# EAGLE design sonar_ampandadc (EAGLE 7.6.0)

## Sheet 1 of 2: Differential VGA Breakout Board Purpose: ARVP SONAR system for 2017 RoboSub competition lmh6514 <http://www.ti.com/lit/ds/symlink/lmh6514.pdf> to be used for prototype v1. Created by Mike Bardwell (10/2016) Parts List 43nH Inductor <http://www.digikey.ca/product-detail/en/murata-electronics-north-america/LQW15AN43NJ00D/490-6818-1-ND/3846015> 10 pF Capacitor <http://www.digikey.ca/product-detail/en/kemet/C0603C100J5GACTU/399-1049-1-ND/411324>
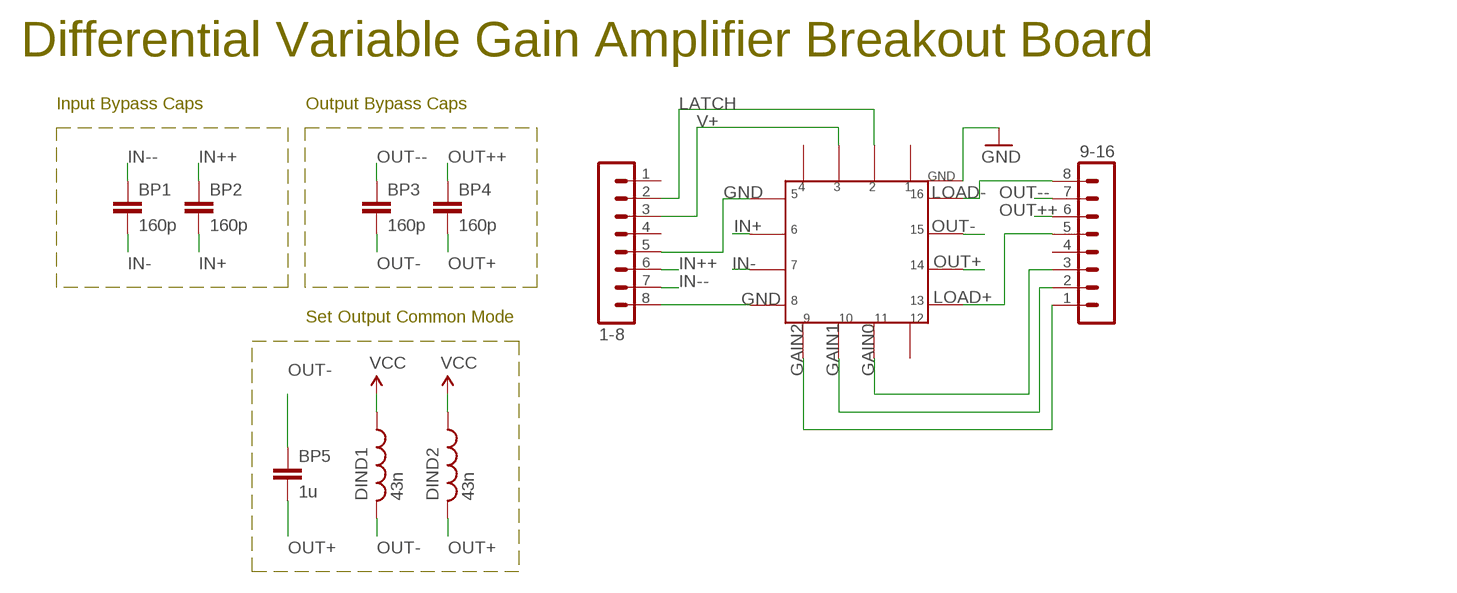
[diagram p0: schematic, sheet 1]

### Parts
1-8  MA08-1  [MA08-1]
9-16  MA08-1  [MA08-1]
BP1  160p  CAP0603-CAP  [0603-CAP]
BP2  160p  CAP0603-CAP  [0603-CAP]
BP3  160p  CAP0603-CAP  [0603-CAP]
BP4  160p  CAP0603-CAP  [0603-CAP]
BP5  1u  CAP0603-CAP  [0603-CAP]
DIND1  43n  L-0402  [0402-RES]
DIND2  43n  L-0402  [0402-RES]
U$1  LMH6514  [WQFN4X4]

### Nets
GAIN0: 9-16.3 U$1.P$11
GAIN1: 9-16.2 U$1.P$10
GAIN2: 9-16.1 U$1.P$9
GND: 1-8.5 1-8.8 U$1.GND U$1.P$5 U$1.P$8 ; also sheet 2
IN+: BP2.2 U$1.P$6
IN++: 1-8.6 BP2.1
IN-: BP1.2 U$1.P$7
IN--: 1-8.7 BP1.1
LATCH: 1-8.2 U$1.P$2
LOAD+: 9-16.5 U$1.P$13 ; also sheet 2
LOAD-: 9-16.8 U$1.P$16 ; also sheet 2
OUT+: BP4.2 BP5.2 DIND2.2 U$1.P$14
OUT++: 9-16.6 BP4.1 ; also sheet 2
OUT-: BP3.2 BP5.1 DIND1.2 U$1.P$15
OUT--: 9-16.7 BP3.1 ; also sheet 2
V+: 1-8.3 DIND1.1 DIND2.1 U$1.P$3 ; supply symbol labelled VCC ; also sheet 2
Unconnected: 1-8.1 1-8.4 9-16.4 U$1.P$1 U$1.P$4 U$1.P$12

### Notes on the sheet
- Differential Variable Gain Amplifier Breakout Board
- Input Bypass Caps | Output Bypass Caps
- Set Output Common Mode

## Sheet 2 of 2: ADS8318 ADC Datasheet <http://www.ti.com/lit/ds/symlink/ads8318.pdf> Created by Mike Bardwell (12/2016)
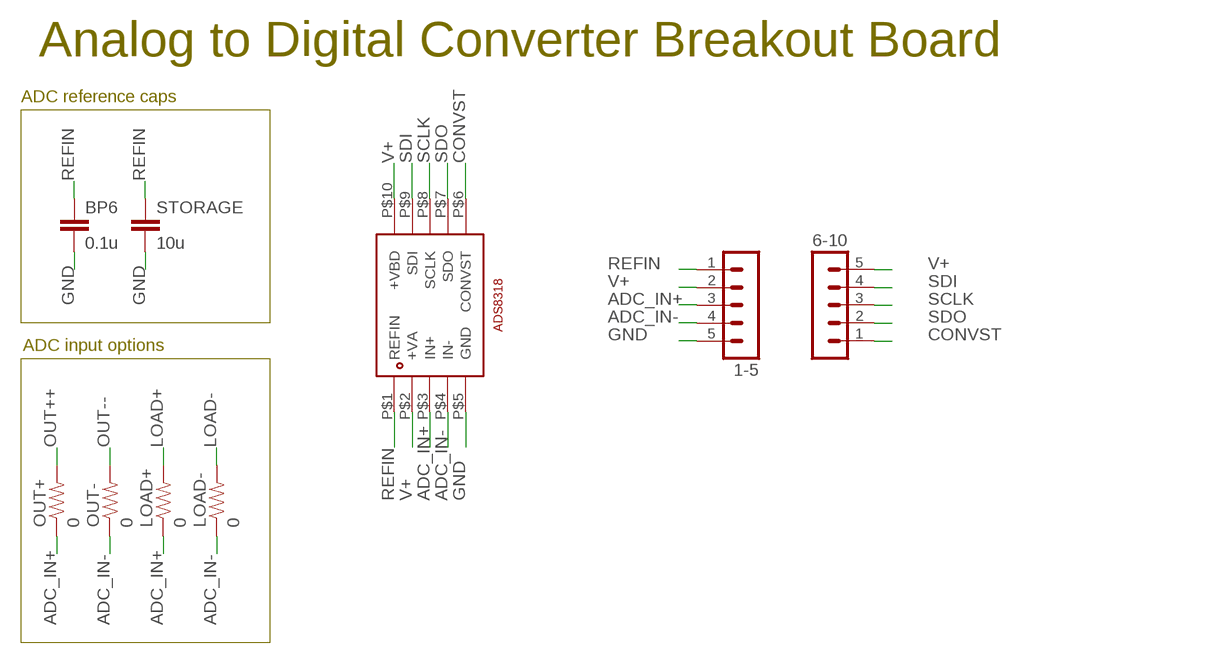
[diagram p1: schematic, sheet 2]

### Parts
1-5  MA05-1  [MA05-1]
6-10  MA05-1  [MA05-1]
BP6  0.1u  CAP0603-CAP  [0603-CAP]
LOAD+  0  RESISTOR0603  [0603-RES]
LOAD-  0  RESISTOR0603  [0603-RES]
OUT+  0  RESISTOR0603  [0603-RES]
OUT-  0  RESISTOR0603  [0603-RES]
STORAGE  10u  CAP0603-CAP  [0603-CAP]
U$2  ADS8318  [10-VSSOP]

### Nets
ADC_IN+: 1-5.3 LOAD+.1 OUT+.1 U$2.P$3(IN+)
ADC_IN-: 1-5.4 LOAD-.1 OUT-.1 U$2.P$4(IN-)
CONVST: 6-10.1 U$2.P$6(CONVST)
GND: 1-5.5 BP6.2 STORAGE.2 U$2.P$5(GND) ; also sheet 1
LOAD+: LOAD+.2 ; also sheet 1
LOAD-: LOAD-.2 ; also sheet 1
OUT++: OUT+.2 ; also sheet 1
OUT--: OUT-.2 ; also sheet 1
REFIN: 1-5.1 BP6.1 STORAGE.1 U$2.P$1(REFIN)
SCLK: 6-10.3 U$2.P$8(SCLK)
SDI: 6-10.4 U$2.P$9(SDI)
SDO: 6-10.2 U$2.P$7(SDO)
V+: 1-5.2 6-10.5 U$2.P$2(+VA) U$2.P$10(+VBD) ; also sheet 1

### Notes on the sheet
- Analog to Digital Converter Breakout Board
- ADC reference caps
- ADC input options

## Library data of the parts
1-5 6-10 = con-lstb:MA05-1: PIN HEADER; OC_FARNELL: unknown; OC_NEWARK: unknown
1-8 9-16 = con-lstb:MA08-1: PIN HEADER; OC_FARNELL: unknown; OC_NEWARK: unknown
BP1-BP6 STORAGE = SparkFun-Capacitors:CAP: Capacitor Standard 0603 ceramic capacitor, and 0.1" leaded capacitor.
DIND1 DIND2 = SONAR:L-0402
LOAD+ LOAD- OUT+ OUT- = SparkFun-Resistors:RESISTOR: Resistor Basic schematic elements and footprints for 0603, 1206, and PTH resistors.
U$1 = SONAR:LMH6514: Differential VGA Purpose: ARVP SONAR system for 2017 RoboSub competition lmh6514 <http://www.ti.com/lit/ds/symlink/lmh6514.pdf> to be used for prototype v1. Created by Mike Bardwell (10/2016) Adjustable Gain with a 42 dB Range Precise 6.02 dB Gain Steps Parallel 3 Bit Gain Control On Chip Register Gain Setting Fully Differential Signal Path Single Ended to Differential Capable 200Ω Input Impedance Small Footprint (4 mm x 4 mm) WQFN Package
U$2 = SONAR:ADS8318

## Board
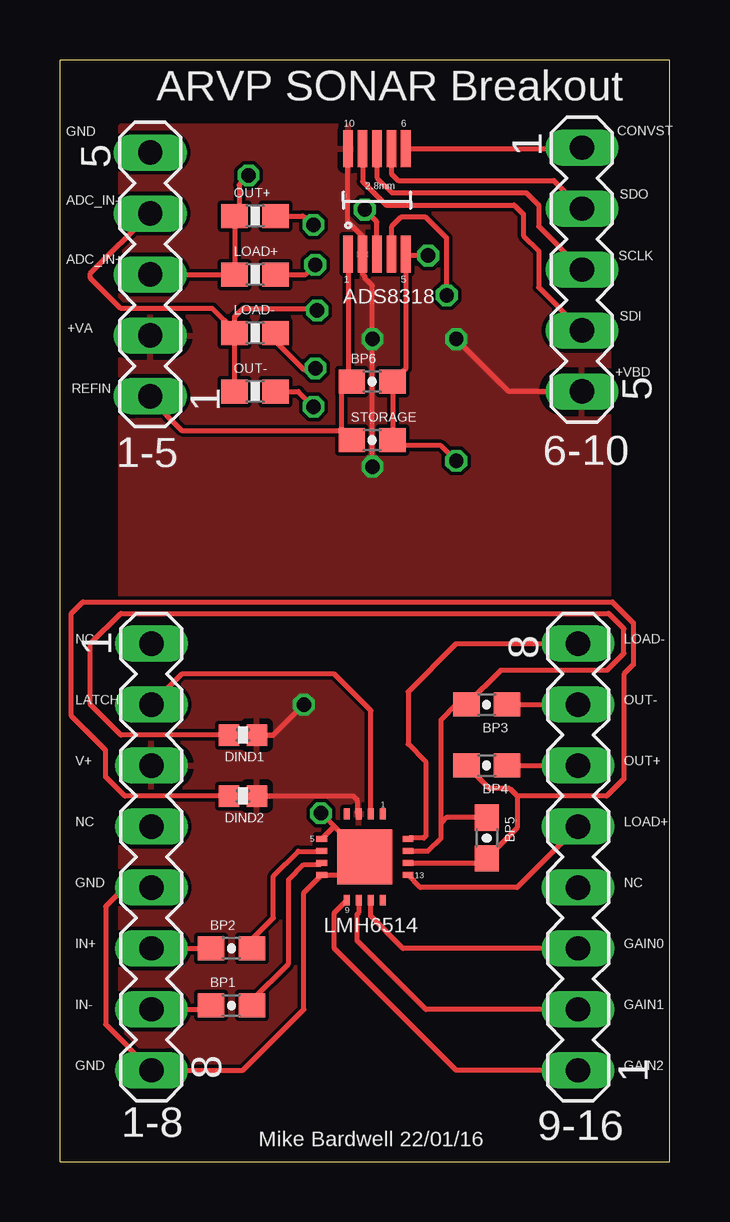
[diagram p2: board, top side]
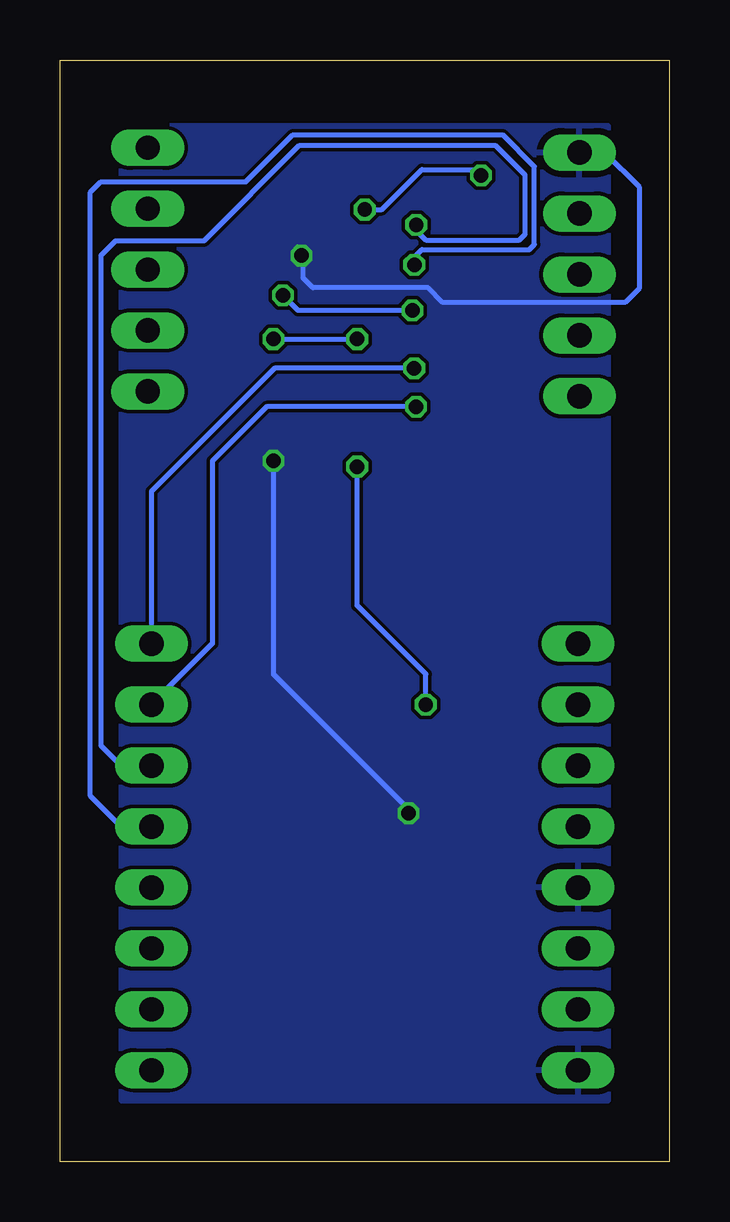
[diagram p3: board, bottom side, seen from below]

Size 25.4 x 45.92 mm. Coordinates in mm from the lower left corner, seen from the top.
Outline: 0,0 25.4,0 25.4,45.92 0,45.92 0,0
Copper layers (1*16): Top 0.035mm / dielectric 1.5mm / Bottom 0.035mm
Design rules "ITEADstudioDRC_fromARVPgit": minimum track width 6mil, minimum drill 12mil, track to track 6mil, track to pad 6mil, pad to pad 6mil, via to via 6mil, smd to smd 0mil, copper to edge 10mil, drill to drill 10mil, minimum pad ring 10mil, minimum via ring 6mil, stop-mask expansion 2mil, vias tented up to drill 100mil, thermal gap 10mil

### Footprints (pad centres in the part's own frame; a part is rotated, then mirrored left to right if it is on the bottom)
MA05-1 = drill 1.016 long: 1 -5.08,0; 2 -2.54,0; 3 0,0; 4 2.54,0; 5 5.08,0
MA08-1 = drill 1.016 long: 1 -8.89,0; 2 -6.35,0; 3 -3.81,0; 4 -1.27,0; 5 1.27,0; 6 3.81,0; 7 6.35,0; 8 8.89,0
0603-CAP = smd 1.1 x 1: 1 -0.85,0; 2 0.85,0
0402-RES = smd 0.85 x 0.9: 1 -0.58,0; 2 0.58,0
0603-RES = smd 1.1 x 1: 1 -0.85,0; 2 0.85,0
WQFN4X4 = smd 2.3 x 2.3: GND 0,0 | smd 0.25 x 0.45: P$1 0.75,1.8; P$2 0.25,1.8; P$3 -0.25,1.8; P$4 -0.75,1.8; P$9 -0.75,-1.8; P$10 -0.25,-1.8; P$11 0.25,-1.8; P$12 0.75,-1.8 | smd 0.45 x 0.25: P$5 -1.8,0.75; P$6 -1.8,0.25; P$7 -1.8,-0.25; P$8 -1.8,-0.75; P$13 1.8,-0.75; P$14 1.8,-0.25; P$15 1.8,0.25; P$16 1.8,0.75
10-VSSOP = smd 0.4 x 1.55: P$1 -1.2,-2.2; P$2 -0.6,-2.2; P$3 0,-2.2; P$4 0.6,-2.2; P$5 1.2,-2.2; P$6 1.2,2.2; P$7 0.6,2.2; P$8 0,2.2; P$9 -0.6,2.2; P$10 -1.2,2.2

### Placement (x,y rotation side)
1-5  3.76,36.98 90 top
1-8  3.81,12.7 270 top
6-10  21.74,37.19 270 top
9-16  21.59,12.7 90 top
BP1  7.14,6.51 0 top
BP2  7.14,8.89 0 top
BP3  17.78,19.05 180 top
BP4  17.78,16.51 180 top
BP5  17.78,13.49 270 top
BP6  13,32.51 0 top
DIND1  7.62,17.78 180 top
DIND2  7.62,15.24 180 top
LOAD+  8.13,36.98 0 top
LOAD-  8.13,34.54 0 top
OUT+  8.13,39.42 0 top
OUT-  8.13,32.11 0 top
STORAGE  13,30.07 0 top
U$1  12.7,12.7 0 top
U$2  13.21,40.03 0 top

### Tracks (layer width: path | path; a pad name or v marks a point on that pad's centre or on a via)
ADC_IN+  (via drill 0.6)
  Top 0.203: 1-5.3 LOAD+.1 OUT+.1 7.46,39.6 7.46,40.72 v7.86,41.12 | U$2.P$3 13.21,39.18 v12.7,39.69
  Bottom 0.203: v12.7,39.69 11.99,39.69 10.32,41.35 8.1,41.35 v7.86,41.12
ADC_IN-  (via drill 0.6)
  Top 0.203: LOAD-.1 7.28,34.63 6.35,35.56 2.54,35.56 1.27,36.83 1.27,37.03 1-5.4 | LOAD-.1 7.28,35.22 7.62,35.56 10.64,35.56 v10.72,35.48 | OUT-.1 LOAD-.1 | v16.11,36.12 16.11,38.5 15.24,39.37 14.21,39.37 13.81,38.97 U$2.P$4
  Bottom 0.203: v10.72,35.48 15.48,35.48 v16.11,36.12
CONVST
  Top 0.203: U$2.P$6 21.71,42.23 6-10.1
GAIN0
  Top 0.203: 9-16.3 14.29,8.89 12.94,10.24 12.94,10.89 U$1.P$11
GAIN1
  Top 0.203: 9-16.2 15.24,6.35 12.38,9.21 12.38,10.32 12.46,10.4 12.46,10.89 U$1.P$10
GAIN2
  Top 0.203: 9-16.1 16.51,3.81 11.43,8.89 11.43,10.38 U$1.P$9
GND  (via drill 0.6)
  Top 0.203: 11.42,13.97 11.43,13.97 U$1.GND 11.95,11.95 U$1.P$8 10.16,11.21 10.16,6.35 7.62,3.81 1-8.8 1.91,5.71 1.91,10.64 2.7,11.43 1-8.5 | 11.42,13.97 U$1.P$5 | 11.42,13.97 11.42,13.98 v10.87,14.53 | v16.51,29.21 15.88,29.84 14.08,29.84 STORAGE.2 BP6.2 14.41,33.06 U$2.P$5 14.47,37.77 v15.34,37.77
  Bottom 0.203: v10.87,14.53 10.87,14.68 11.43,15.24 16.51,20.32 v16.51,29.21 | 1-5.5 2.69,42.06 1.27,40.64 1.27,36.4 1.85,35.81 9.45,35.81 10.06,36.42 14.86,36.42 15.27,36.83 15.27,37.69 v15.34,37.77
  pour Bottom: 2.54,43.18 22.86,43.18 22.86,2.54 2.54,2.54
IN+
  Top 0.203: BP2.2 7.99,9.26 8.89,10.16 8.89,11.91 9.92,12.94 10.89,12.94 U$1.P$6
IN++
  Top 0.203: 1-8.6 BP2.1
IN-
  Top 0.203: BP1.2 7.99,6.72 9.53,8.26 9.53,11.75 10.16,12.38 10.83,12.38 U$1.P$7
IN--
  Top 0.203: 1-8.7 6.29,6.35 BP1.1
LATCH
  Top 0.203: U$1.P$2 12.95,18.8 11.43,20.32 5.08,20.32 1-8.2
LOAD+  (via drill 0.6)
  Top 0.203: 9-16.5 19.05,11.43 15.02,11.43 U$1.P$13 | LOAD+.2 10.23,36.98 v10.64,37.39
  Bottom 0.203: v10.64,37.39 10.64,37.7 10.32,38.02 5.82,38.02 5.82,38.05 5.64,38.23 5.64,41.48 6.96,42.8 15.7,42.8 17.65,40.84 23.7,40.84 24.13,40.41 24.13,15.24 22.86,13.97 9-16.5
LOAD-  (via drill 0.6)
  Top 0.203: 9-16.8 16.51,21.59 14.5,19.58 14.5,17.4 15.24,16.66 15.24,13.57 15.16,13.49 14.54,13.49 U$1.P$16 | LOAD-.2 8.98,34.2 10.16,33.02 10.59,33.02 v10.64,33.07
  Bottom 0.203: v10.64,33.07 16.46,33.07 21.59,27.94 9-16.8
OUT+
  Top 0.203: 19.05,15.24 18.73,15.56 17.88,15.56 BP4.2 | 19.05,15.24 19.05,13.91 BP5.2 17.6,12.46 14.51,12.46 U$1.P$14 | DIND2.2 2.7,15.24 1.91,16.03 1.91,17.14 0.48,18.57 0.48,22.86 0.95,23.34 23.02,23.34 23.89,22.46 23.89,20.72 23.5,20.32 23.5,15.95 22.78,15.24 19.05,15.24
OUT++  (via drill 0.6)
  Top 0.203: BP4.1 9-16.6 | OUT+.2 10.11,39.42 10.16,39.37 10.24,39.37 v10.56,39.05
  Bottom 0.203: v10.56,39.05 10.56,38.81 10.16,38.42 6.26,38.42 6.02,38.66 6.02,41.12 7.24,42.34 15.44,42.34 19.41,38.38 23.09,38.38 23.7,37.77 23.7,17.35 23.5,17.14 22.86,16.51 9-16.6
OUT-
  Top 0.203: 15.88,14.13 15.88,18.41 16.51,19.05 BP3.2 18.36,20.48 22.78,20.48 23.5,21.19 23.5,22.23 22.86,22.86 2.54,22.86 1.27,21.59 1.27,19.05 2.54,17.78 DIND1.2 | BP5.1 16.09,14.34 15.88,14.13 | U$1.P$15 15.33,12.95 15.88,13.49 15.88,14.13
OUT--  (via drill 0.6)
  Top 0.203: BP3.1 9-16.7 | OUT-.2 9.93,32.11 v10.57,31.47
  Bottom 0.203: v10.57,31.47 16.79,31.47 19.05,29.21 19.05,21.59 9-16.7
REFIN
  Top 0.203: U$2.P$1 12.01,32.66 BP6.1 11.75,32.11 11.75,30.48 | 1-5.1 3.76,31.8 5.08,30.48 11.75,30.48 | 11.75,30.48 STORAGE.1
SCLK
  Top 0.203: U$2.P$8 13.21,41.02 13.84,40.39 19.43,40.39 19.94,39.88 19.94,38.99 6-10.3
SDI
  Top 0.203: U$2.P$9 12.61,40.86 13.59,39.88 18.92,39.88 19.3,39.5 19.3,38.61 19.94,37.97 19.94,36.45 6-10.4
SDO
  Top 0.203: U$2.P$7 13.81,41.18 14.1,40.89 20.57,40.89 6-10.2
V+  (via drill 0.6)
  Top 0.203: DIND2.1 12.22,15.24 12.38,15.08 12.38,14.57 U$1.P$3 | DIND1.1 8.89,17.78 v10.16,19.05 | v13.02,28.97 v13.02,34.29 13.02,36.51 12.7,36.83 12.7,36.91 12.62,36.99 12.62,37.82 U$2.P$2 12.62,37.84 12.62,38.56 11.99,39.19 11.99,42.21 U$2.P$10 | 6-10.5 18.69,32.11 v16.51,34.29
  Bottom 0.203: v10.16,19.05 10.16,20.32 13.02,23.18 v13.02,28.97 | v16.51,34.29 v13.02,34.29
  pour Top: 2.54,43.18 22.86,43.18 22.86,2.54 2.54,2.54

### Text on the board
tNames: ARVP SONAR Breakout | GND | CONVST | ADC_IN- | SDO | SCLK | ADC_IN+ | ADS8318 | +VA | SDI | +VBD | REFIN | NC | LOAD- | LATCH | OUT- | V+ | OUT+ | NC | LOAD+ | GND | NC | LMH6514 | IN+ | GAIN0 | IN- | GAIN1 | GND | GAIN2 | Mike Bardwell 22/01/16